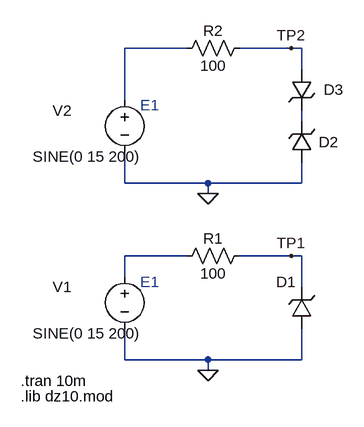
[diagram p0: schematic zener-limiter.asc]
zener-limiter.asc, the LTspice schematic file:
Version 4
SHEET 1 880 680
WIRE 112 -576 16 -576
WIRE 272 -576 192 -576
WIRE 288 -576 272 -576
WIRE 288 -544 288 -576
WIRE 16 -496 16 -576
WIRE 288 -464 288 -480
WIRE 16 -368 16 -416
WIRE 144 -368 16 -368
WIRE 288 -368 288 -400
WIRE 288 -368 144 -368
WIRE 144 -352 144 -368
WIRE 112 -256 16 -256
WIRE 272 -256 192 -256
WIRE 288 -256 272 -256
WIRE 16 -224 16 -256
WIRE 288 -208 288 -256
WIRE 16 -96 16 -144
WIRE 144 -96 16 -96
WIRE 288 -96 288 -144
WIRE 288 -96 144 -96
WIRE 144 -80 144 -96
FLAG 144 -80 0
FLAG 272 -256 TP1
FLAG 272 -576 TP2
FLAG 144 -352 0
SYMBOL res 96 -240 R270
WINDOW 0 27 56 VTop 2
WINDOW 3 5 56 VBottom 2
SYMATTR InstName R1
SYMATTR Value 100
SYMBOL zener 304 -144 R180
WINDOW 0 24 72 Left 2
WINDOW 3 -145 -2 Left 2
SYMATTR InstName D1
SYMATTR Value ""
SYMBOL voltage 16 -240 R0
WINDOW 0 -111 32 Left 2
WINDOW 3 -142 103 Left 2
WINDOW 123 0 0 Left 2
WINDOW 39 0 0 Left 2
SYMATTR InstName V1
SYMATTR Value SINE(0 15 200)
SYMBOL res 96 -560 R270
WINDOW 0 27 56 VTop 2
WINDOW 3 5 56 VBottom 2
SYMATTR InstName R2
SYMATTR Value 100
SYMBOL zener 304 -400 R180
WINDOW 0 -41 31 Left 2
WINDOW 3 -145 -2 Left 2
SYMATTR InstName D2
SYMATTR Value ""
SYMBOL voltage 16 -512 R0
WINDOW 0 -111 32 Left 2
WINDOW 3 -142 103 Left 2
WINDOW 123 0 0 Left 2
WINDOW 39 0 0 Left 2
SYMATTR InstName V2
SYMATTR Value SINE(0 15 200)
SYMBOL zener 272 -544 R0
WINDOW 0 50 32 Left 2
SYMATTR InstName D3
SYMATTR Value ""
TEXT -144 -64 Left 2 !.tran 10m
TEXT 40 -216 Left 2 ;E1
TEXT -144 -40 Left 2 !.lib dz10.mod
TEXT 40 -488 Left 2 ;E1

The netlist it stands for:
* zener-limiter.asc
R1 N003 TP1 100
D1 0 TP1
V1 N003 0 SINE(0 15 200)
R2 N001 TP2 100
D2 0 N002
V2 N001 0 SINE(0 15 200)
D3 TP2 N002
.model D D
.lib standard.dio
.tran 10m
* E1
.lib dz10.mod
* E1
.backanno
.end